# EAGLE design motors_ctrl (EAGLE 5.10)
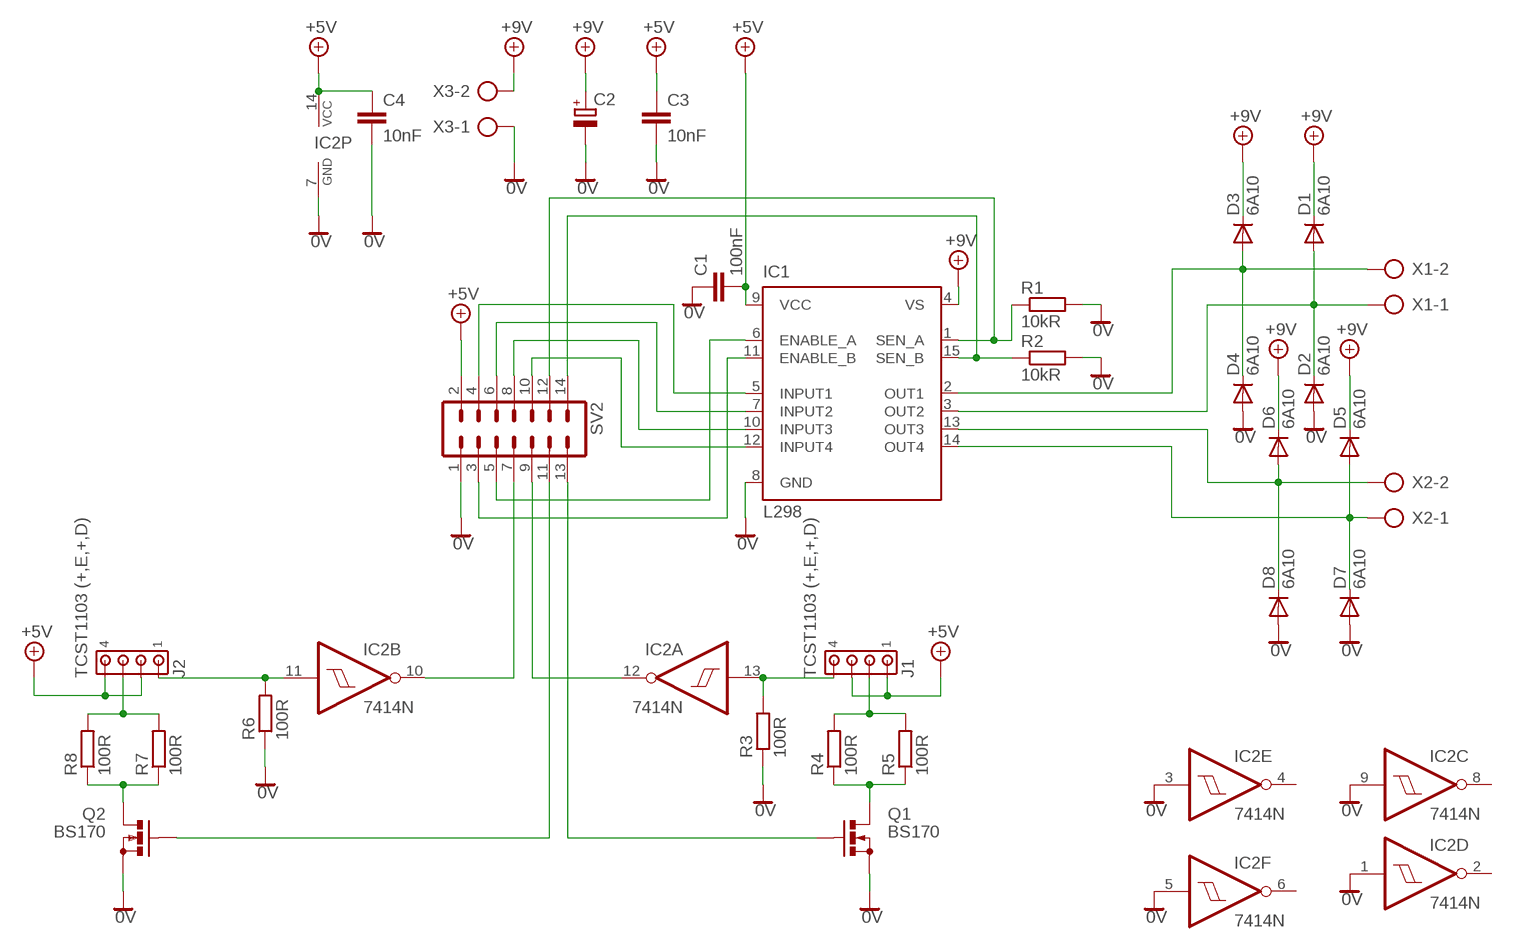
[diagram p0: schematic, sheet 1]

## Parts
C1  100nF  C-EU050-025X075  [C050-025X075]
C2  CPOL-EUE7.5-18  [E7,5-18]
C3  10nF  C-EU050-025X075  [C050-025X075]
C4  10nF  C-EU050-025X075  [C050-025X075]
D1  6A10  UF5400  [DO201-15]
D2  6A10  UF5400  [DO201-15]
D3  6A10  UF5400  [DO201-15]
D4  6A10  UF5400  [DO201-15]
D5  6A10  UF5400  [DO201-15]
D6  6A10  UF5400  [DO201-15]
D7  6A10  UF5400  [DO201-15]
D8  6A10  UF5400  [DO201-15]
IC1  L298  [MULTIWATT-15]
IC2  7414N  [DIL14]
J1  TCST1103 (+,E,+,D)  1445055-4  [1445055-4]
J2  TCST1103 (+,E,+,D)  1445055-4  [1445055-4]
Q1  BS170  [SOT54E]
Q2  BS170  [SOT54E]
R1  10kR  R-EU_0207/12  [0207/12]
R2  10kR  R-EU_0207/12  [0207/12]
R3  100R  R-EU_0207/12  [0207/12]
R4  100R  R-EU_0207/12  [0207/12]
R5  100R  R-EU_0207/12  [0207/12]
R6  100R  R-EU_0207/12  [0207/12]
R7  100R  R-EU_0207/12  [0207/12]
R8  100R  R-EU_0207/12  [0207/12]
SV2  ML14  [ML14]
X1  AK300/2  [AK300/2]
X2  AK300/2  [AK300/2]
X3  AK300/2  [AK300/2]

## Nets
0V: C1.1 C2.- C3.2 C4.2 D2.A D4.A D7.A D8.A IC1.8(GND) IC2.1(D:I) IC2.3(E:I) IC2.5(F:I) IC2.7(P:GND) IC2.9(C:I) Q1.S Q2.S R1.2 R2.2 R3.1 R6.1 SV2.1 X3.1
+5V: C1.2 C3.1 C4.1 IC1.9(VCC) IC2.14(P:VCC) J1.1 J1.3 J2.2 J2.4 SV2.2
+9V: C2.+ D1.C D3.C D5.C D6.C IC1.4(VS) X3.2
N$1: D1.A D2.C IC1.3(OUT2) X1.1
N$2: D3.A D4.C IC1.2(OUT1) X1.2
N$3: D6.A D8.C IC1.13(OUT3) X2.2
N$4: D5.A D7.C IC1.14(OUT4) X2.1
N$5: IC1.15(SEN_B) R2.1 SV2.14
N$6: IC1.1(SEN_A) R1.1 SV2.12
N$7: IC1.12(INPUT4) SV2.10
N$8: IC1.10(INPUT3) SV2.8
N$9: IC1.7(INPUT2) SV2.6
N$10: IC1.5(INPUT1) SV2.4
N$11: IC1.6(ENABLE_A) SV2.5
N$12: IC1.11(ENABLE_B) SV2.3
N$13: Q1.G SV2.13
N$14: IC2.13(A:I) J1.4 R3.2
N$15: J1.2 R4.2 R5.2
N$16: Q1.D R4.1 R5.1
N$17: IC2.12(A:O) SV2.9
N$18: IC2.11(B:I) J2.1 R6.2
N$20: J2.3 R7.2 R8.2
N$21: Q2.D R7.1 R8.1
N$22: Q2.G SV2.11
N$23: IC2.10(B:O) SV2.7
Unconnected: IC2.2(D:O) IC2.4(E:O) IC2.6(F:O) IC2.8(C:O)

## Library data of the parts
C1 C3 C4 = rcl:C-EU: CAPACITOR, European symbol
C2 = rcl:CPOL-EU: POLARIZED CAPACITOR, European symbol
D1-D8 = diode:UF5400: DIODE ultra fast rectifier, 3 A
IC1 = st-microelectronics:L298: DUAL FULL-BRIDGE DRIVER
IC2 = 74xx-eu:74*14: Hex schmitt trigger INVERTER
J1 J2 = con-amp:1445055-4: Micro MATE-N-LOK Connectors grid 1.5 mm Source: ENG_CD_1445055_A.pdf
Q1 Q2 = transistor-small-signal:BS170: N-CHANNEL MOS FET
R1-R8 = rcl:R-EU_: RESISTOR, European symbol
SV2 = con-harting-ml:ML14: HARTING
X1-X3 = con-ptr500:AK300/2: CONNECTOR

## Board
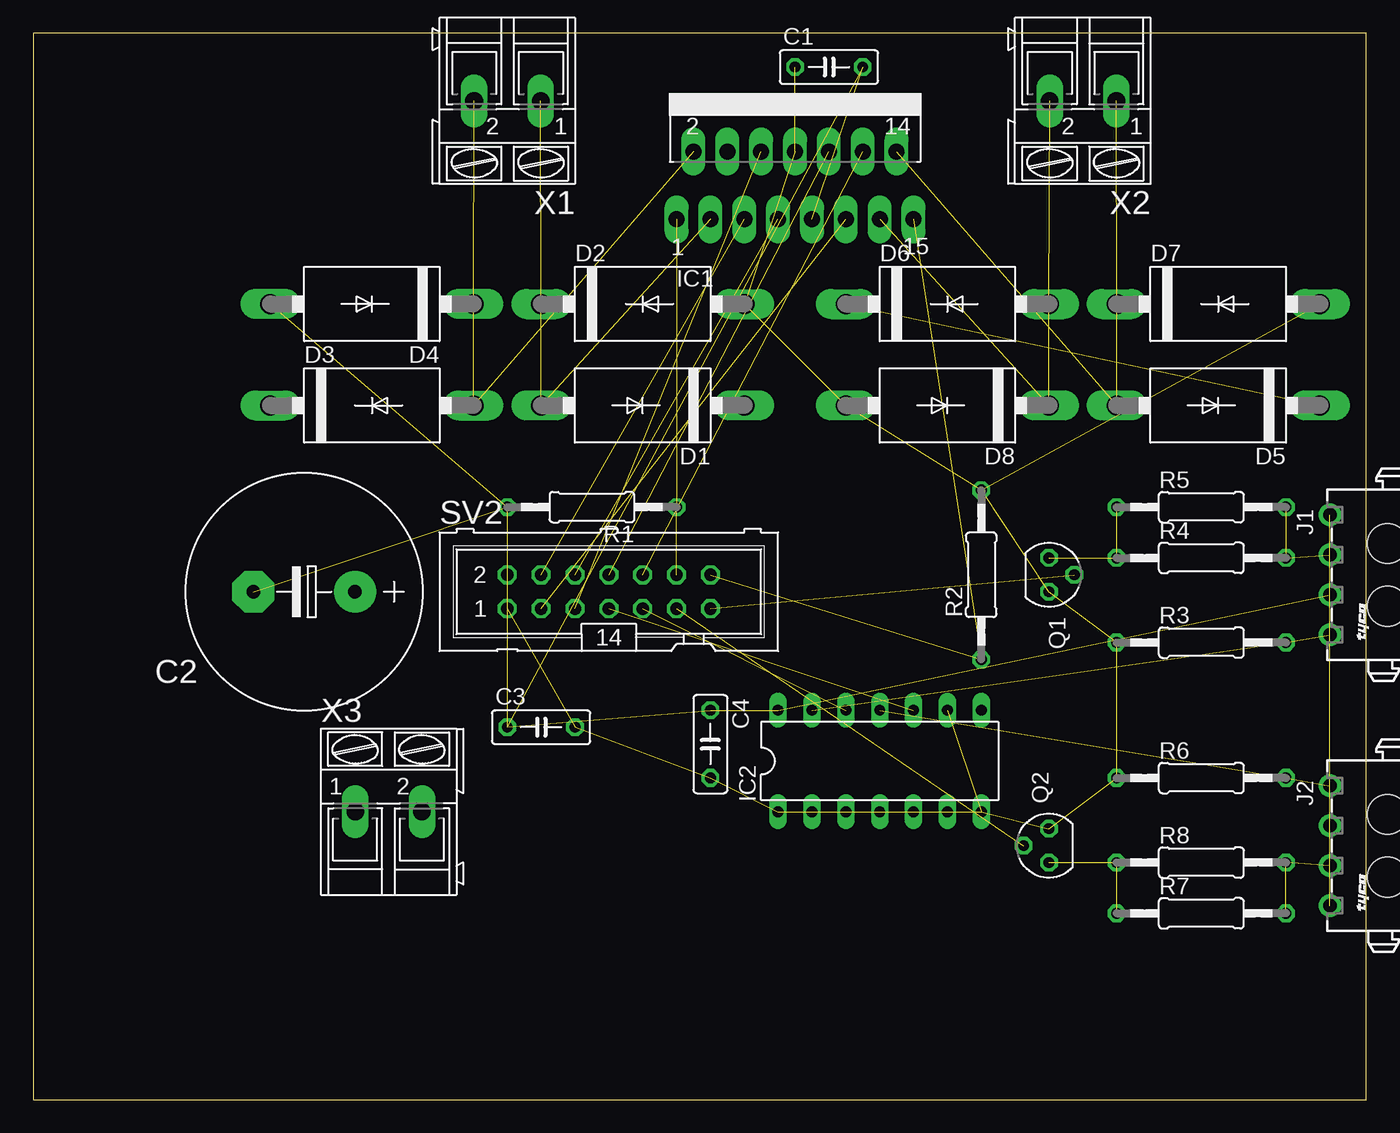
[diagram p1: board, top side]
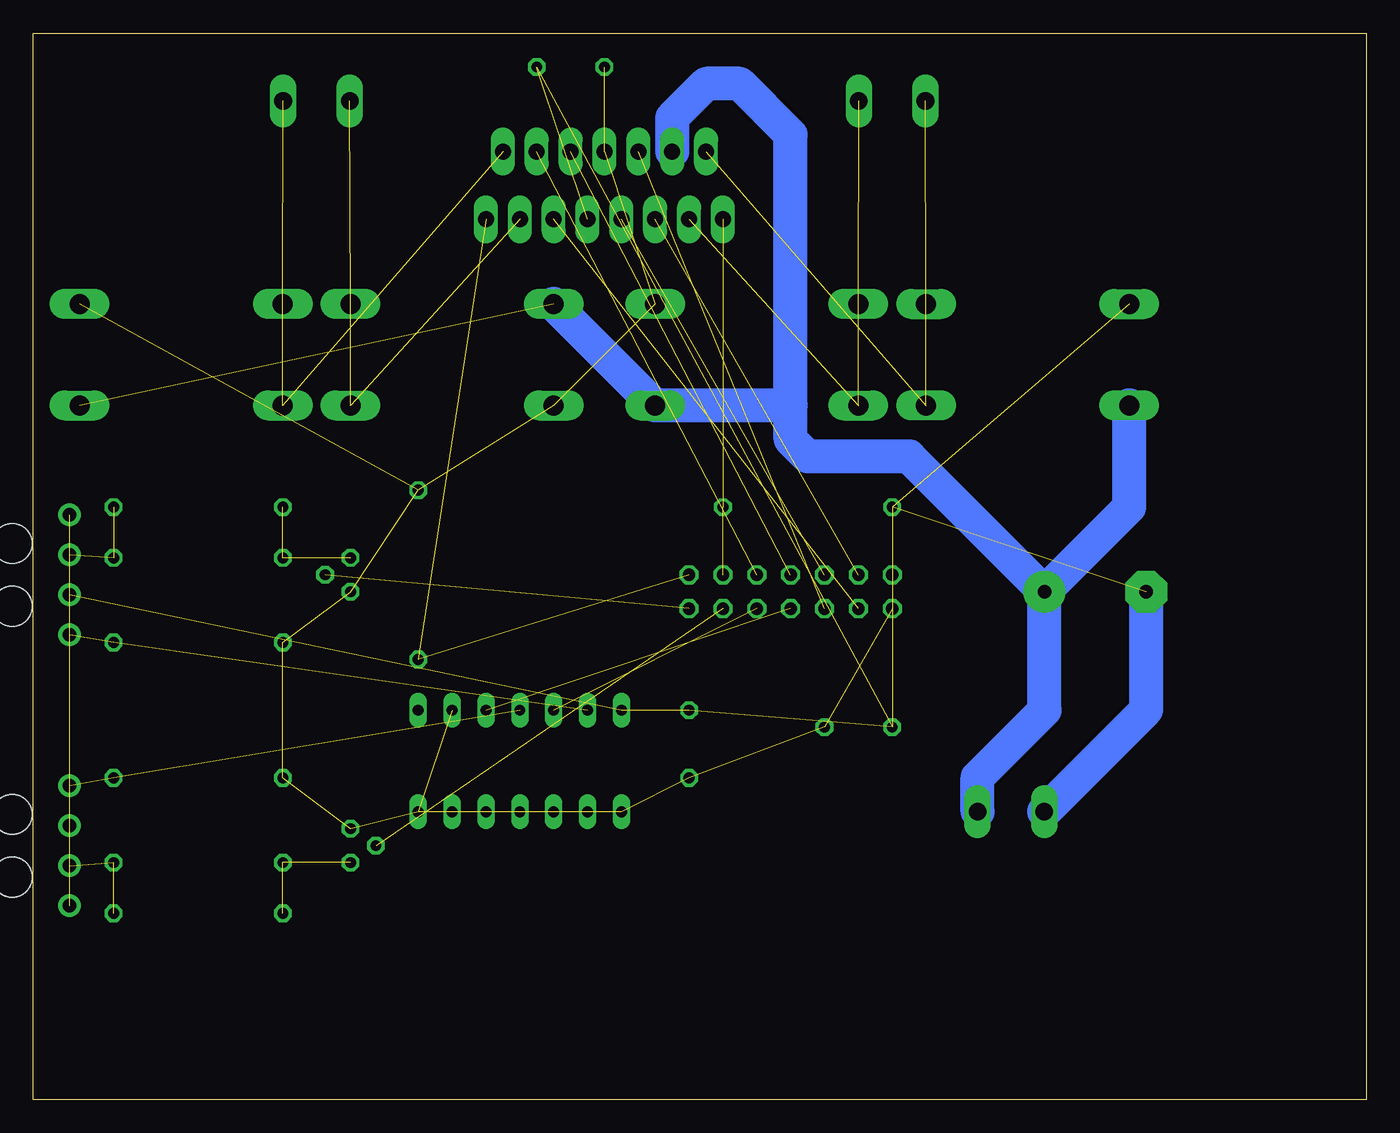
[diagram p2: board, bottom side, seen from below]

Size 100 x 80 mm. Coordinates in mm from the lower left corner, seen from the top.
Outline: 0,0 100,0 100,80 0,80 0,0
Copper layers (1*16): Top 0.035mm / dielectric 1.5mm / Bottom 0.035mm
Design rules "default": minimum track width 10mil, minimum drill 24mil, track to track 8mil, track to pad 8mil, pad to pad 8mil, via to via 8mil, smd to smd 8mil, copper to edge 40mil, drill to drill 8mil, minimum pad ring 10mil, minimum via ring 8mil, stop-mask expansion 4mil, vias tented up to drill 0mil, thermal gap 10mil

### Footprints (pad centres in the part's own frame; a part is rotated, then mirrored left to right if it is on the bottom)
C050-025X075 = drill 0.813 octagon: 1 -2.54,0; 2 2.54,0
E7,5-18 = drill 1.016 pad 3.15 round: + -3.81,0 | drill 1.016 pad 3.15 octagon: - 3.81,0
DO201-15 = drill 1.499 long: A 7.62,0; C -7.62,0
MULTIWATT-15 = drill 1.2 long: 1 -8.89,-7.62; 2 -7.62,-2.54; 3 -6.35,-7.62; 4 -5.08,-2.54; 5 -3.81,-7.62; 6 -2.54,-2.54; 7 -1.27,-7.62; 8 0,-2.54; 9 1.27,-7.62; 10 2.54,-2.54; 11 3.81,-7.62; 12 5.08,-2.54; 13 6.35,-7.62; 14 7.62,-2.54; 15 8.89,-7.62
DIL14 = drill 0.813 long: 1 -7.62,-3.81; 2 -5.08,-3.81; 3 -2.54,-3.81; 4 0,-3.81; 5 2.54,-3.81; 6 5.08,-3.81; 7 7.62,-3.81; 8 7.62,3.81; 9 5.08,3.81; 10 2.54,3.81; 11 0,3.81; 12 -2.54,3.81; 13 -5.08,3.81; 14 -7.62,3.81
1445055-4 = drill 1 pad 1.676 round: 1 4.5,4.32; 2 1.5,4.32; 3 -1.5,4.32; 4 -4.5,4.32 | hole 3: -2.35,0; 2.35,0
SOT54E = drill 0.813 octagon: D -1.27,0; G 0,1.905; S 1.27,0
0207/12 = drill 0.813 octagon: 1 -6.35,0; 2 6.35,0
ML14 = drill 0.914 octagon: 1 -7.62,-1.27; 2 -7.62,1.27; 3 -5.08,-1.27; 4 -5.08,1.27; 5 -2.54,-1.27; 6 -2.54,1.27; 7 0,-1.27; 8 0,1.27; 9 2.54,-1.27; 10 2.54,1.27; 11 5.08,-1.27; 12 5.08,1.27; 13 7.62,-1.27; 14 7.62,1.27
AK300/2 = drill 1.321 long: 1 -2.515,0; 2 2.489,0

### Placement (x,y rotation side)
C1  59.69,77.47 0 top
C2  20.32,38.1 180 top
C3  38.1,27.94 0 top
C4  50.8,26.67 270 top
D1  45.72,52.07 180 top
D2  45.72,59.69 0 top
D3  25.4,52.07 0 top
D4  25.4,59.69 180 top
D5  88.9,52.07 180 top
D6  68.58,59.69 0 top
D7  88.9,59.69 0 top
D8  68.58,52.07 180 top
IC1  57.15,73.66 0 top
IC2  63.5,25.4 0 top
J1  101.6,39.37 90 top
J2  101.6,19.05 90 top
Q1  76.2,39.37 270 top
Q2  76.2,19.05 90 top
R1  41.91,44.45 180 top
R2  71.12,39.37 90 top
R3  87.63,34.29 0 top
R4  87.63,40.64 0 top
R5  87.63,44.45 0 top
R6  87.63,24.13 0 top
R7  87.63,13.97 0 top
R8  87.63,17.78 0 top
SV2  43.18,38.1 0 top
X1  35.56,74.93 180 top
X2  78.74,74.93 180 top
X3  26.67,21.59 0 top

### Tracks (layer width: path | path; a pad name or v marks a point on that pad's centre or on a via)
0V  (20 unrouted)
  Bottom 0.406: X3.1 24.13,21.59
  Bottom 2.54: C2.- 16.51,29.23 X3.1
+5V  (9 unrouted)
+9V  (1 unrouted)
  Bottom 2.54: C2.+ 17.78,44.45 D3.C | X3.2 29.16,24.18 24.13,29.21 C2.+ | C2.+ 34.29,48.26 41.91,48.26 43.18,49.53 43.18,52.07 | 43.18,52.07 43.18,72.39 46.99,76.2 49.53,76.2 52.07,73.66 IC1.4 | 43.18,52.07 D1.C D6.C
N$1  (3 unrouted)
N$2  (3 unrouted)
N$3  (3 unrouted)
N$4  (3 unrouted)
N$5  (2 unrouted)
N$6  (2 unrouted)
N$7  (1 unrouted)
N$8  (1 unrouted)
N$9  (1 unrouted)
N$10  (1 unrouted)
N$11  (1 unrouted)
N$12  (1 unrouted)
N$13  (1 unrouted)
N$14  (2 unrouted)
N$15  (2 unrouted)
N$16  (2 unrouted)
N$17  (1 unrouted)
N$18  (2 unrouted)
N$20  (2 unrouted)
N$21  (2 unrouted)
N$22  (1 unrouted)
N$23  (1 unrouted)